# Altium project MiniRobot.PrjPcb
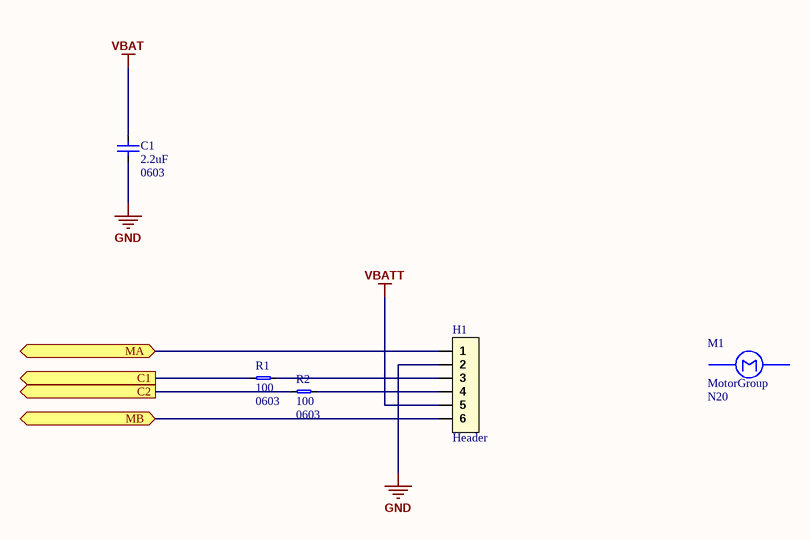
[diagram p0: MR_Motor.SchDoc]
5 sheets, 26 parts. Net scope: flat (ports and power ports of the same name join across sheets).
Board file: MiniRobot.PcbDoc
Sheets:
  MR_Motor.SchDoc
  MR_Motor_Control.SchDoc
  MR_Power.SchDoc
  MR_RangeSensor.SchDoc
  MR_UartConnector.SchDoc

## Sheet MR_Motor.SchDoc
size A4; CompanyName: BeeIonic; SheetNumber: 2; SheetTotal: 7

### Parts
C1  value 2.2uF  Package: 0603  [0603_CAP_LD]  (hidden comment: CerCap)
H1  Header  [HEADER_1X6_PICOBLADE_653106124022]
M1  MotorGroup  Reference: N20  [MotorGroup]
R1  value 100  Package: 0603  [0603_RES_LD]  (hidden comment: Resistor)
R2  value 100  Package: 0603  [0603_RES_LD]  (hidden comment: Resistor)

### Ports
C1 (out), C2 (out), MA (bidir), MB (bidir)

### Nets
GND: C1.1 H1.2
VBAT: C1.2
VBATT: H1.5
NetH1_1: H1.1 ; port MA
NetH1_3: H1.3 R1.2
NetH1_4: H1.4 R2.2
NetH1_6: H1.6 ; port MB
NetR1_1: R1.1 ; port C1
NetR2_1: R2.1 ; port C2

### Notes on the sheet
- Project :
- Title :
- Sheet:
- of
- Creation Date :
- Designer :
- Modified Date :

### Library data of the parts
C1 = CerCap: Ceramic Capacitor; Type: *; Voltage/Power: *
H1 = Header_6x1: Header 6x1 Pins
M1 = Motor
R1 R2 = Resistor: Precision: *

## Sheet MR_Motor_Control.SchDoc
size A4; CompanyName: BeeIonic; SheetNumber: 3; SheetTotal: 7
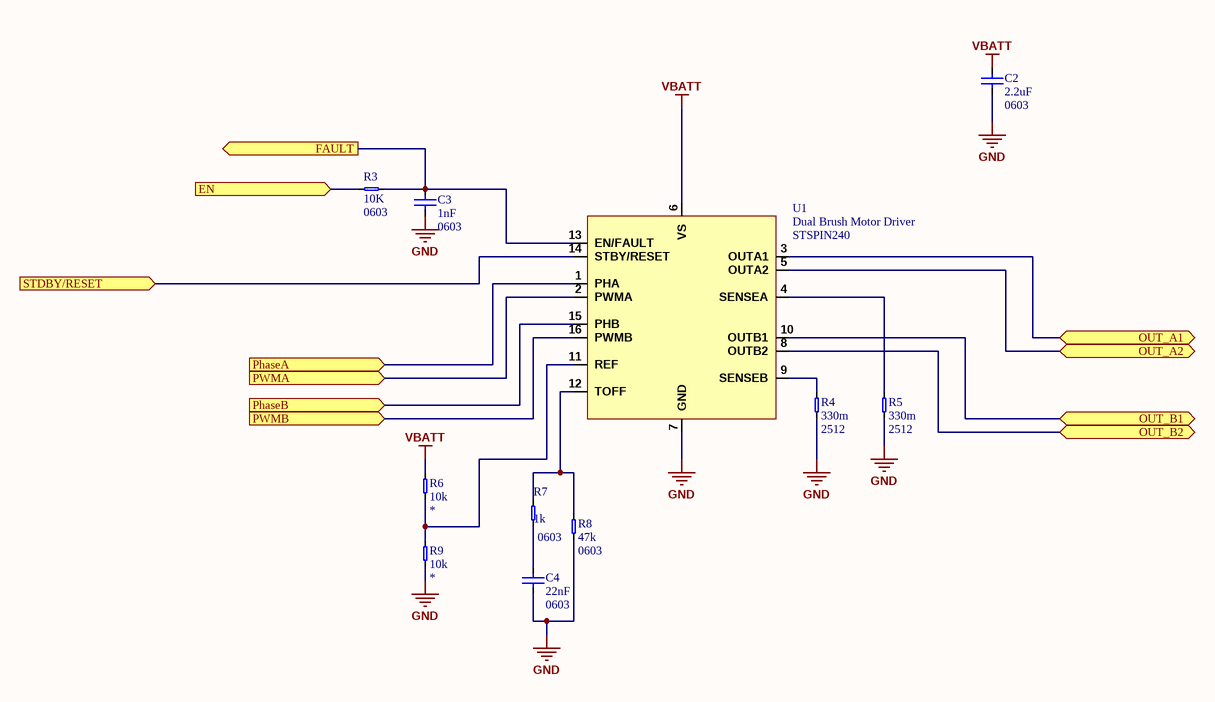
[diagram p1: MR_Motor_Control.SchDoc]

### Parts
C2  value 2.2uF  Package: 0603  [0603_CAP_LD]  (hidden comment: CerCap)
C3  value 1nF  Package: 0603  [0603_CAP_LD]  (hidden comment: CerCap)
C4  value 22nF  Package: 0603  [0603_CAP_LD]  (hidden comment: CerCap)
R3  value 10K  Package: 0603  [0603_RES_LD]  (hidden comment: Resistor)
R4  value 330m  Package: 2512  [2512_RES_LD]  (hidden comment: Resistor)
R5  value 330m  Package: 2512  [2512_RES_LD]  (hidden comment: Resistor)
R6  value 10k  [0603_RES_LD]  (hidden comment: Resistor)
R7  value 1k  Package: 0603  [0603_RES_LD]  (hidden comment: Resistor)
R8  value 47k  Package: 0603  [0603_RES_LD]  (hidden comment: Resistor)
R9  value 10k  [0603_RES_LD]  (hidden comment: Resistor)
U1  Dual Brush Motor Driver  [QFN-STSPIN240]

### Ports
EN (in), FAULT (out), OUT_A1 (bidir), OUT_A2 (bidir), OUT_B1 (bidir), OUT_B2 (bidir), PhaseA (in), PhaseB (in), PWMA (in), PWMB (in), STDBY/RESET (in)

### Nets
GND: C2.1 C3.1 C4.1 R4.1 R5.1 R8.1 R9.1 U1.7(GND)
VBATT: C2.2 R6.2 U1.6(VS)
NetC3_2: C3.2 R3.1 U1.13(EN/FAULT) ; port FAULT
NetC4_2: C4.2 R7.1
NetR3_2: R3.2 ; port EN
NetR4_2: R4.2 U1.9(SENSEB)
NetR5_2: R5.2 U1.4(SENSEA)
NetR6_1: R6.1 R9.2 U1.11(REF)
NetR7_2: R7.2 R8.2 U1.12(TOFF)
NetU1_1: U1.1(PHA) ; port PhaseA
NetU1_2: U1.2(PWMA) ; port PWMA
NetU1_3: U1.3(OUTA1) ; port OUT_A1
NetU1_5: U1.5(OUTA2) ; port OUT_A2
NetU1_8: U1.8(OUTB2) ; port OUT_B2
NetU1_10: U1.10(OUTB1) ; port OUT_B1
NetU1_14: U1.14(STBY/RESET) ; port STDBY/RESET
NetU1_15: U1.15(PHB) ; port PhaseB
NetU1_16: U1.16(PWMB) ; port PWMB

### Notes on the sheet
- Project :
- Title :
- Sheet:
- of
- Creation Date :
- Designer :
- Modified Date :

### Library data of the parts
C2-C4 = CerCap: Ceramic Capacitor; Type: *; Voltage/Power: *
U1 = STSPIN240: ST Dual Motor Driver; Reference: STSPIN240
R3-R9 = Resistor: Precision: *
  R6 R9: Package: *

## Sheet MR_Power.SchDoc
size A4; CompanyName: BeeIonic; SheetNumber: 5; SheetTotal: 7
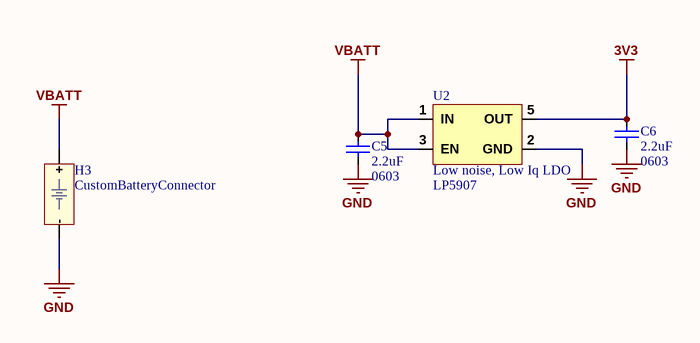
[diagram p2: MR_Power.SchDoc]

### Parts
C5  value 2.2uF  Package: 0603  [0603_CAP_LD]  (hidden comment: CerCap)
C6  value 2.2uF  Package: 0603  [0603_CAP_LD]  (hidden comment: CerCap)
H3  CustomBatteryConnector  [CustomBatteryConnector]
U2  Low noise, Low Iq LDO  [LP5907]

### Nets
3V3: C6.2 U2.5(OUT)
GND: C5.1 C6.1 H3.- U2.2(GND)
VBATT: C5.2 H3.+ U2.1(IN) U2.3(EN)

Not connected (* = marked no-connect by the designer): U2 4(NC)

### Notes on the sheet
- Project :
- Title :
- Sheet:
- of
- Creation Date :
- Designer :
- Modified Date :

### Library data of the parts
C5 C6 = CerCap: Ceramic Capacitor; Type: *; Voltage/Power: *
H3 = BatteryConnector: Custom Battery Connector
U2 = LP5907: LP5907 Low Noise Low Iq LDO; Reference: LP5907

## Sheet MR_RangeSensor.SchDoc
size A4; CompanyName: BeeIonic; SheetNumber: 6; SheetTotal: 7
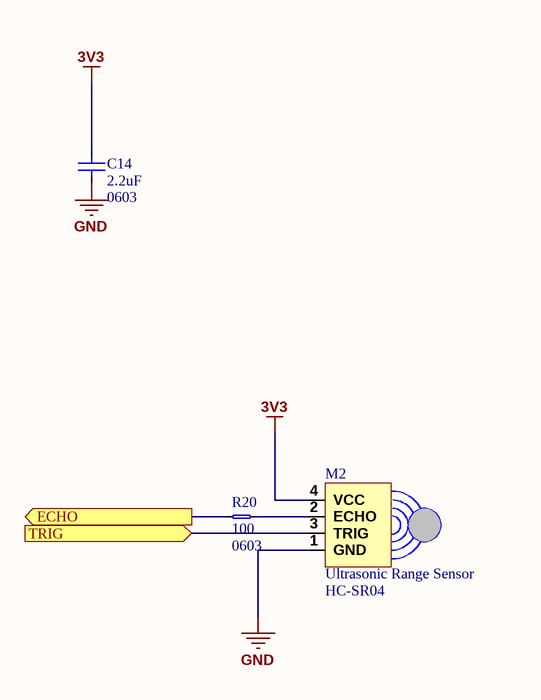
[diagram p3: MR_RangeSensor.SchDoc]

### Parts
C14  value 2.2uF  Package: 0603  [0603_CAP_LD]  (hidden comment: CerCap)
M2  Ultrasonic Range Sensor  [HC-SR04]
R20  value 100  Package: 0603  [0603_RES_LD]  (hidden comment: Resistor)

### Ports
ECHO (out), TRIG (in)

### Nets
3V3: C14.2 M2.4(VCC)
GND: C14.1 M2.1(GND)
NetM2_2: M2.2(ECHO) R20.2
NetM2_3: M2.3(TRIG) ; port TRIG
NetR20_1: R20.1 ; port ECHO

### Notes on the sheet
- Project :
- Title :
- Sheet:
- of
- Creation Date :
- Designer :
- Modified Date :

### Library data of the parts
C14 = CerCap: Ceramic Capacitor; Type: *; Voltage/Power: *
M2 = HC-SR04: Reference: HC-SR04
R20 = Resistor: Precision: *

## Sheet MR_UartConnector.SchDoc
size A4; CompanyName: BeeIonic; SheetNumber: 7; SheetTotal: 7
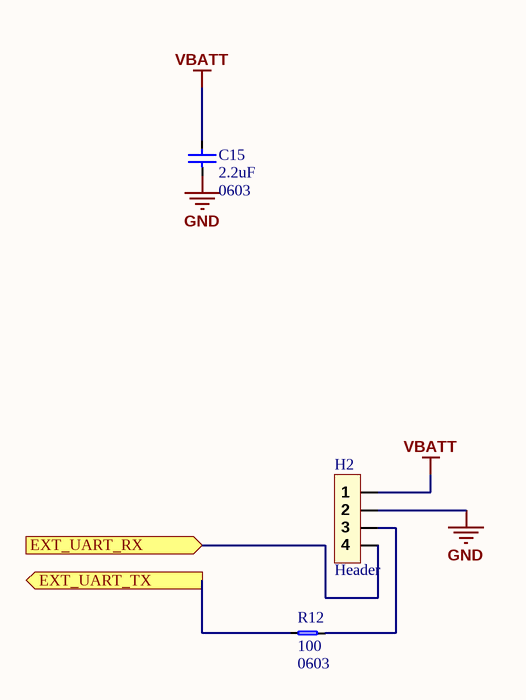
[diagram p4: MR_UartConnector.SchDoc]

### Parts
C15  value 2.2uF  Package: 0603  [0603_CAP_LD]  (hidden comment: CerCap)
H2  Header  [HE14 1x4 Straight]
R12  value 100  Package: 0603  [0603_RES_LD]  (hidden comment: Resistor)

### Ports
EXT_UART_RX (in), EXT_UART_TX (out)

### Nets
GND: C15.1 H2.2
VBATT: C15.2 H2.1
NetH2_3: H2.3 R12.2
NetH2_4: H2.4 ; port EXT_UART_RX
NetR12_1: R12.1 ; port EXT_UART_TX

### Notes on the sheet
- Project :
- Title :
- Sheet:
- of
- Creation Date :
- Designer :
- Modified Date :

### Library data of the parts
C15 = CerCap: Ceramic Capacitor; Type: *; Voltage/Power: *
H2 = Header_4x1: Header 4x1 PIns
R12 = Resistor: Precision: *

## Nets that join several sheets
3V3: MR_Power (C6.2 U2.5), MR_RangeSensor (C14.2 M2.4)
GND: MR_Motor (C1.1 H1.2), MR_Motor_Control (8 pins), MR_Power (C5.1 C6.1 H3.- U2.2), MR_RangeSensor (C14.1 M2.1), MR_UartConnector (C15.1 H2.2)
VBATT: MR_Motor (H1.5), MR_Motor_Control (C2.2 R6.2 U1.6), MR_Power (C5.2 H3.+ U2.1 U2.3), MR_UartConnector (C15.2 H2.1)